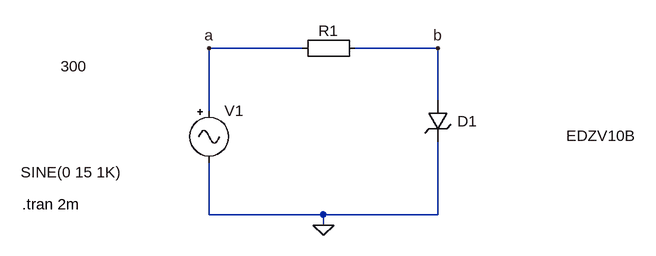
[diagram p0: schematic Z-CL-NEG-SIN.asc]
Z-CL-NEG-SIN.asc, the LTspice schematic file:
Version 4
SHEET 1 880 680
WIRE 16 48 -128 48
WIRE 224 48 96 48
WIRE 224 128 224 48
WIRE -128 144 -128 48
WIRE -128 304 -128 224
WIRE 48 304 -128 304
WIRE 224 304 224 192
WIRE 224 304 48 304
WIRE 48 320 48 304
FLAG -128 48 a
FLAG 224 48 b
FLAG 48 320 0
SYMBOL Misc\\EuropeanResistor 0 64 R270
WINDOW 0 27 56 VTop 2
WINDOW 3 4 -336 VBottom 2
SYMATTR InstName R1
SYMATTR Value 300
SYMBOL zener 208 128 R0
WINDOW 0 46 32 Left 2
WINDOW 3 214 55 Left 2
SYMATTR InstName D1
SYMATTR Value EDZV10B
SYMATTR Description Diode
SYMATTR Type diode
SYMBOL Misc\\signal -128 128 R0
WINDOW 123 0 0 Left 2
WINDOW 39 0 0 Left 2
WINDOW 3 -290 111 Left 2
SYMATTR Value SINE(0 15 1K)
SYMATTR InstName V1
TEXT -416 288 Left 2 !.tran 2m

The netlist it stands for:
* Z-CL-NEG-SIN.asc
R1 a b 300
D1 b 0 EDZV10B
V1 a 0 SINE(0 15 1K)
.model D D
.lib standard.dio
.tran 2m
.backanno
.end